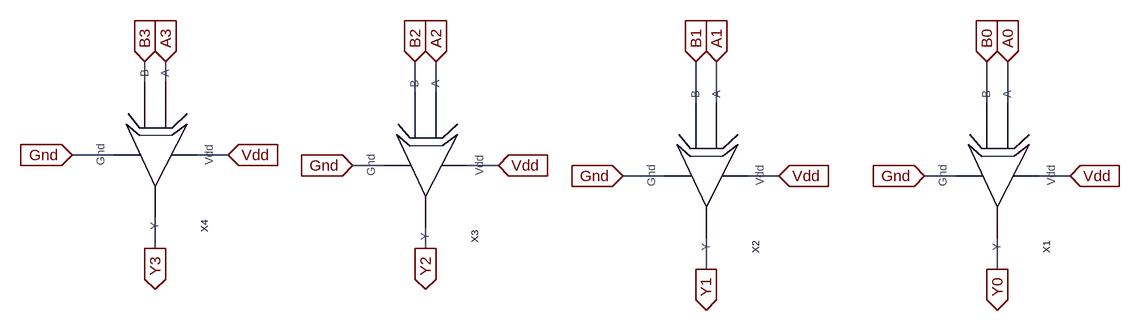
[diagram p0: schematic ALU_XOR.asc]
ALU_XOR.asc, the LTspice schematic file:
Version 4
SHEET 1 880 680
WIRE -800 48 -800 16
WIRE -768 48 -768 16
WIRE -384 64 -384 16
WIRE -352 64 -352 16
WIRE 48 80 48 16
WIRE 80 80 80 16
WIRE 496 80 496 16
WIRE 528 80 528 16
WIRE -848 160 -912 160
WIRE -672 160 -720 160
WIRE -432 176 -480 176
WIRE -256 176 -304 176
WIRE 0 192 -64 192
WIRE 176 192 128 192
WIRE 448 192 400 192
WIRE 624 192 576 192
WIRE -784 304 -784 256
WIRE -368 304 -368 272
WIRE 64 336 64 288
WIRE 512 336 512 288
FLAG 512 336 Y0
IOPIN 512 336 Out
FLAG 64 336 Y1
IOPIN 64 336 Out
FLAG -368 304 Y2
IOPIN -368 304 Out
FLAG -784 304 Y3
IOPIN -784 304 Out
FLAG 528 16 A0
IOPIN 528 16 In
FLAG 80 16 A1
IOPIN 80 16 In
FLAG -352 16 A2
IOPIN -352 16 In
FLAG -768 16 A3
IOPIN -768 16 In
FLAG 496 16 B0
IOPIN 496 16 In
FLAG 48 16 B1
IOPIN 48 16 In
FLAG -384 16 B2
IOPIN -384 16 In
FLAG -800 16 B3
IOPIN -800 16 In
FLAG 176 192 Vdd
IOPIN 176 192 In
FLAG 624 192 Vdd
IOPIN 624 192 In
FLAG -256 176 Vdd
IOPIN -256 176 In
FLAG -672 160 Vdd
IOPIN -672 160 In
FLAG 400 192 Gnd
IOPIN 400 192 In
FLAG -64 192 Gnd
IOPIN -64 192 In
FLAG -480 176 Gnd
IOPIN -480 176 In
FLAG -912 160 Gnd
IOPIN -912 160 In
SYMBOL XOR1 528 160 R90
SYMATTR InstName X1
SYMBOL XOR1 80 160 R90
SYMATTR InstName X2
SYMBOL XOR1 -352 144 R90
SYMATTR InstName X3
SYMBOL XOR1 -768 128 R90
SYMATTR InstName X4

The netlist it stands for:
* ALU_XOR.asc
XX1 Vdd Gnd A0 B0 Y0 XOR1  ; pins Vdd Gnd A B Y
XX2 Vdd Gnd A1 B1 Y1 XOR1  ; pins Vdd Gnd A B Y
XX3 Vdd Gnd A2 B2 Y2 XOR1  ; pins Vdd Gnd A B Y
XX4 Vdd Gnd A3 B3 Y3 XOR1  ; pins Vdd Gnd A B Y
.backanno
.end